# Altium schematic sheet PWM_CON_PowerSupply.SchDoc: PWM Motor Controller - Power Supply
size A4; DocumentNumber: 1; Revision: 2; SheetNumber: 1; SheetTotal: 4; DrawnBy: T. Burns; Organization: N/A; ProjectName: PWM Motor Controller
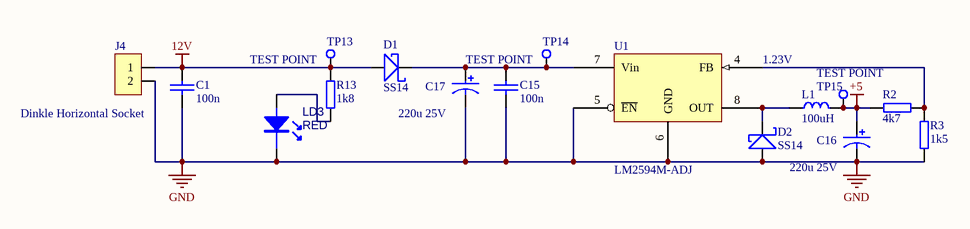
[diagram p0: PWM_CON_PowerSupply.SchDoc]

## Parts
C1  100n  [0603]
C15  100n  [0603]
C16  220u 25V  [RB.15/.32]
C17  220u 25V  [RB.15/.32]
D1  SS14  [DO-214AC]
D2  SS14  [DO-214AC]
J4  Dinkle Horizontal Socket  [WEID2R]
L1  100uH  [INDUCTOR6B]
LD3  RED  [0805DIODE]
R2  4k7  [0603]
R3  1k5  [0603]
R13  1k8  [0603]
TP13  TEST POINT  [TEST POINT]
TP14  TEST POINT  [TEST POINT]
TP15  TEST POINT  [TEST POINT]
U1  LM2594M-ADJ  [M08A_N]

## Nets
12V: C1.2 D1.A J4.1 R13.1 TP13.1
+5: C16.1 L1.2 R2.1 TP15.1
GND: C1.1 C15.1 C16.2 C17.2 D2.A J4.2 LD3.K R3.2 U1.5(~{EN}) U1.6(GND)
NetC15_2: C15.2 C17.1 D1.K TP14.1 U1.7(Vin)
NetD2_K: D2.K L1.1 U1.8(OUT)
NetLD3_A: LD3.A R13.2
NetR2_2: R2.2 R3.1 U1.4(FB)

## Notes on the sheet
- 1.23V
- Title
- Size:
- Date:
- A4
- Number:
- Time:
- Revision:
- Sheet
- of
- File:

## Library data of the parts
C1 C15 = CAP: PartNo: R8835; Supplier: Altronics
C16 C17 = CAPACITOR POL-S: PartNo: R5144; Supplier: Altronics
D1 D2 = DIODE SCHOTTKY-S: SCHOTTKY , 1A, 40V; PartNo: 4085159; Supplier: Element14; Repetitive Reverse Voltage: 40V; Forward Current: 1A
J4 = CON2: PartNo: P2552; Supplier: Altronics
L1 = INDUCTOR6: 0.5A Inductor; PartNo: L6222; Supplier: Altronics
LD3 = LED: PartNo: Y1107; Supplier: Altronics
R2 = RES8: 1% Resistor; PartNo: R1644; Supplier: Altronics
R3 = RES8: 1% Resistor; PartNo: R1608; Supplier: Altronics
R13 = RES8: 1% Resistor; PartNo: R1614; Supplier: Altronics
TP13-TP15 = TEST POINT: Probe compatible test point
U1 = LM2594: SMPS 0.5A; PartNo: 9494332; Vin - Min: 40; Vin - Max: 4.5; Out Current: 500mA; Freq: 150KHz; Supplier: Element14